# Altium schematic sheet LEDeep_project.SchDoc
size A3; SheetNumber: 1; SheetTotal: 7
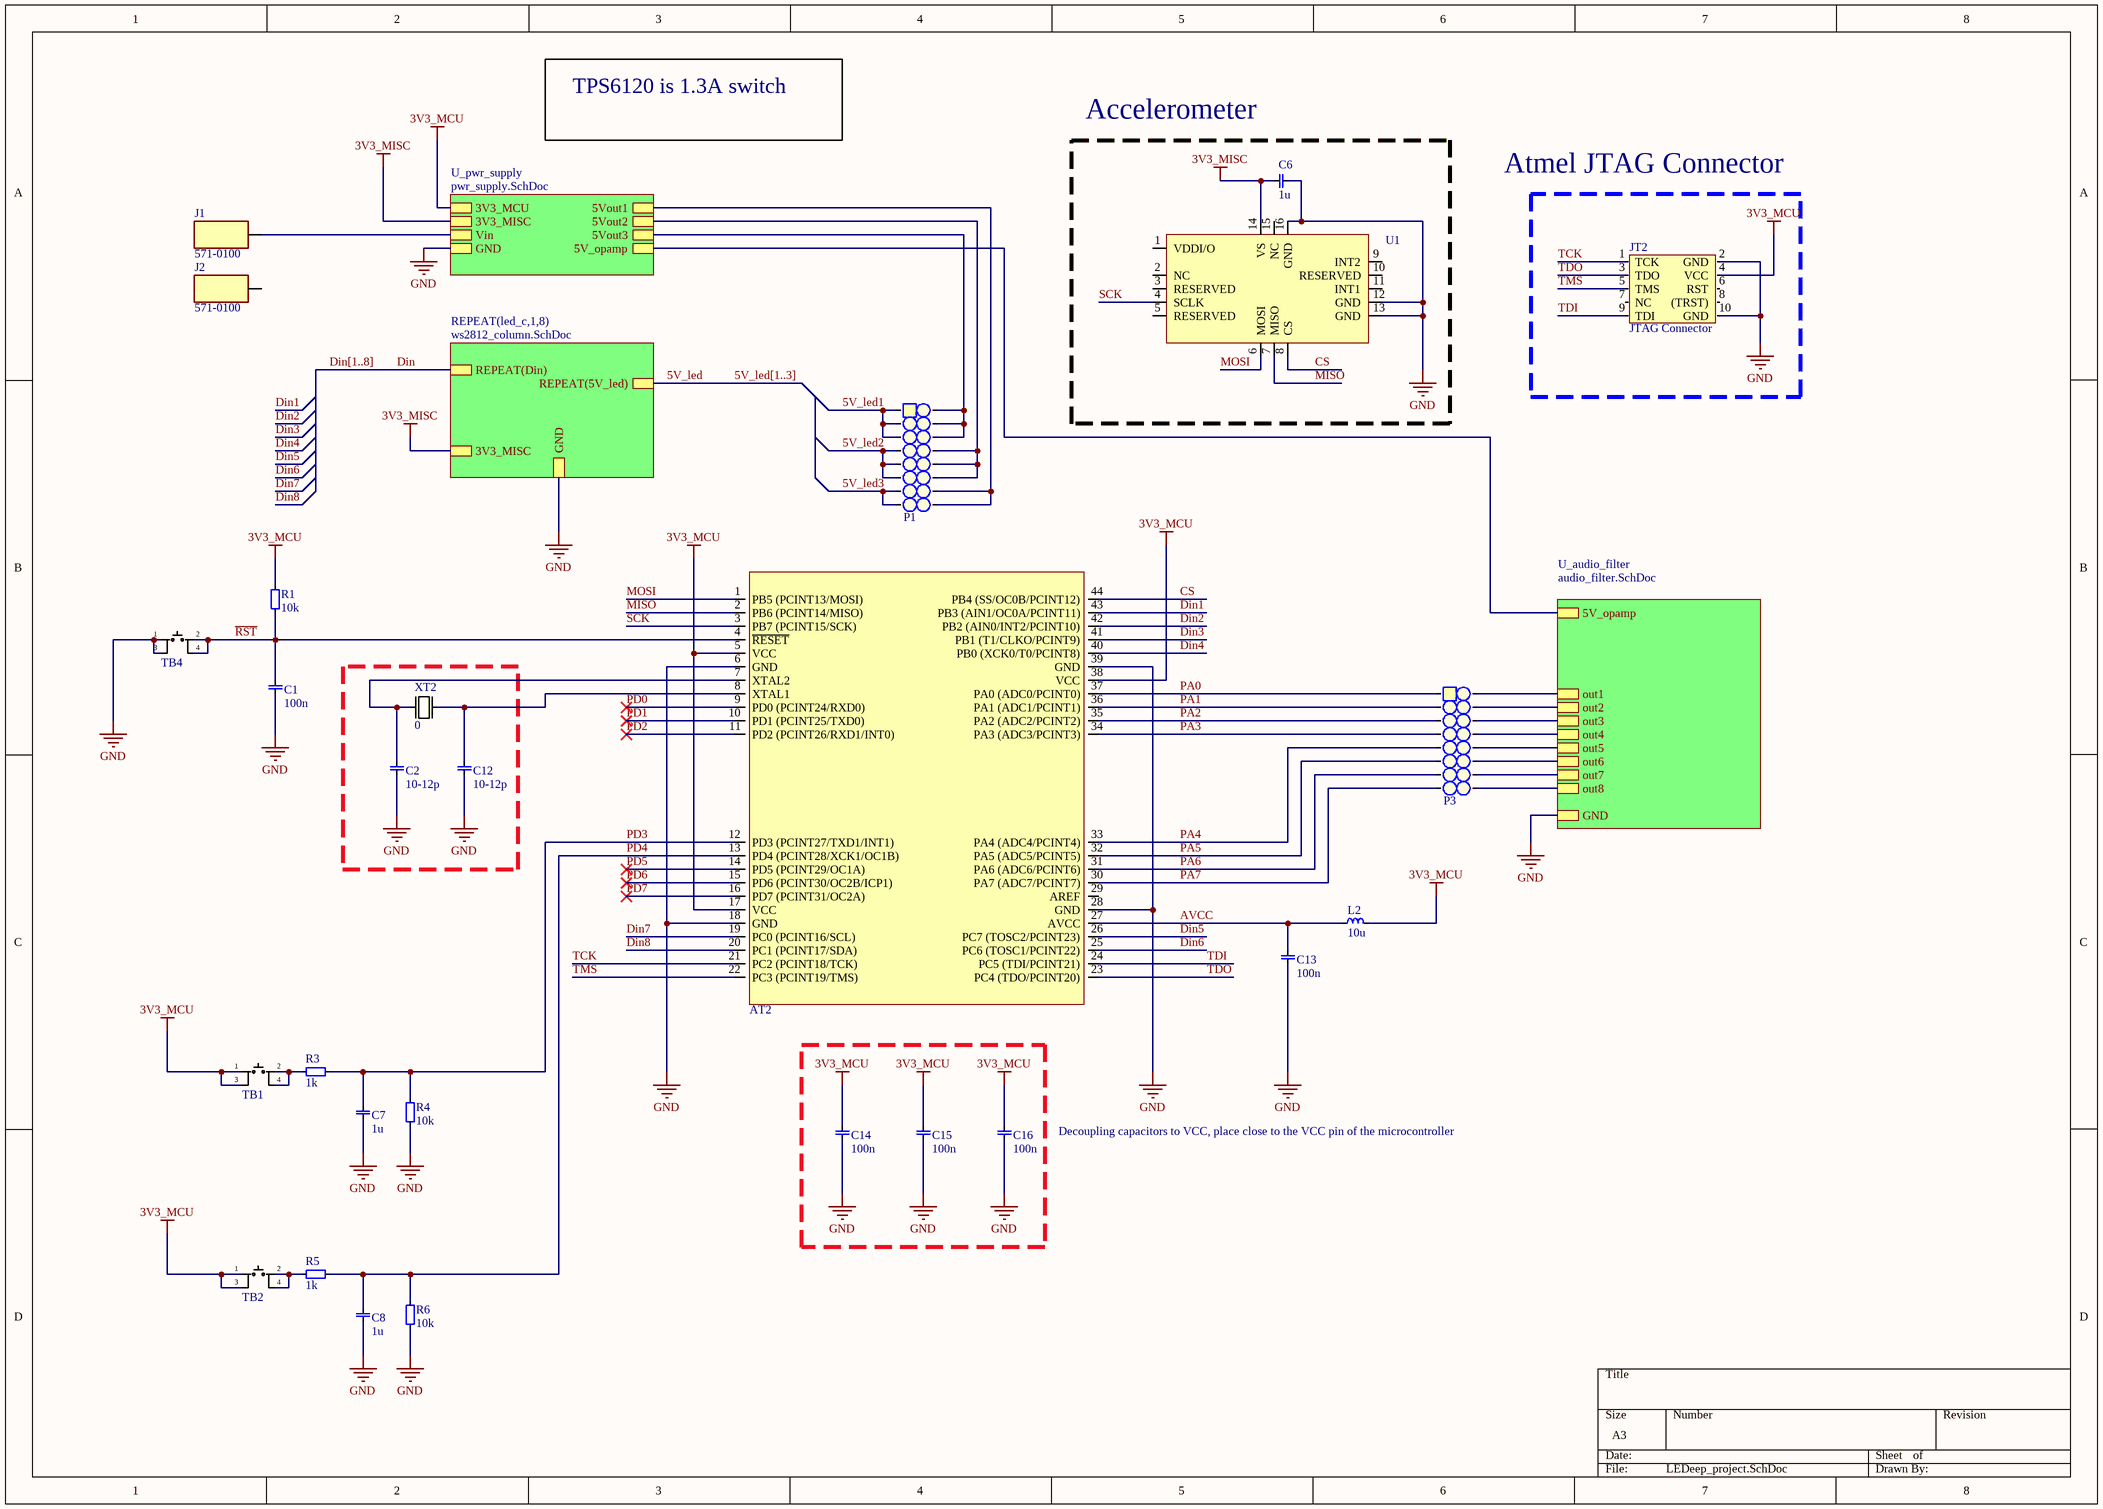
[diagram p0: LEDeep_project.SchDoc]

## Parts
AT2  ATmega644PA  [TQFP-44]  (value not drawn)
C1  value 100n  [1206, capasitor]  (hidden comment: 1206, capacitor)
C2  value 10-12p  [1206, capasitor]  (hidden comment: 1206, capacitor)
C6  value 1u  [1206, capasitor]  (hidden comment: 1206, capacitor)
C7  value 1u  [1206, capasitor]  (hidden comment: 1206, capacitor)
C8  value 1u  [1206, capasitor]  (hidden comment: 1206, capacitor)
C12  value 10-12p  [1206, capasitor]  (hidden comment: 1206, capacitor)
C13  value 100n  [1206, capasitor]  (hidden comment: 1206, capacitor)
C14  value 100n  [1206, capasitor]  (hidden comment: 1206, capacitor)
C15  value 100n  [1206, capasitor]  (hidden comment: 1206, capacitor)
C16  value 100n  [1206, capasitor]  (hidden comment: 1206, capacitor)
J1  571-0100  [Banana Conn VCC]
J2  571-0100  [Banana Conn VCC]
JT2  JTAG Connector  [Atmel_JTAG]
L2  value 10u  [1812, coil]  (hidden comment: Coil)
P1  2x8 Pin Header  [2x8 Pin Header]  (value not drawn)
P3  2x8 Pin Header  [2x8 Pin Header]  (value not drawn)
R1  value 10k  [1206]  (hidden comment: 1206, resistor)
R3  value 1k  [1206]  (hidden comment: 1206, resistor)
R4  value 10k  [1206]  (hidden comment: 1206, resistor)
R5  value 1k  [1206]  (hidden comment: 1206, resistor)
R6  value 10k  [1206]  (hidden comment: 1206, resistor)
TB1  Tactile Button  [Button smd]  (value not drawn)
TB2  Tactile Button  [Button smd]  (value not drawn)
TB4  Tactile Button  [Button smd]  (value not drawn)
U1  ADXL344  [lag_16_5by3_3x3mm]  (value not drawn)
XT2  value 0  [XTAL_SMD_LP]  (hidden comment: XTAL TXC 7A)

## Blocks framed on the sheet
Accelerometer: C6 U1

## Sub-sheets
REPEAT(led_c,1,8) = ws2812_column.SchDoc: GND, REPEAT(5V_led), REPEAT(Din), 3V3_MISC
U_audio_filter = audio_filter.SchDoc: 5V_opamp, GND, out6, out2, out3, out5, out1, out4, out7, out8
U_pwr_supply = pwr_supply.SchDoc: Vin, GND, 5Vout1, 5Vout2, 5Vout3, 3V3_MISC, 3V3_MCU, 5V_opamp

## Nets
3V3_MCU: AT2.5(VCC) AT2.17(VCC) AT2.38(VCC) C14.1 C15.1 C16.1 JT2.4(VCC) L2.1 R1.0 TB1.1 TB1.3 TB2.1 TB2.3 ; sheet U_pwr_supply/3V3_MCU
3V3_MISC: C6.0 U1.14(VS) ; sheet U_pwr_supply/3V3_MISC, sheet REPEAT(led_c,1,8)/3V3_MISC
GND: AT2.6(GND) AT2.18(GND) AT2.28(GND) AT2.39(GND) C1.0 C2.0 C6.1 C7.0 C8.0 C12.0 C13.0 C14.0 C15.0 C16.0 JT2.2(GND) JT2.10(GND) R4.1 R6.1 TB4.1 TB4.3 U1.12(GND) U1.13(GND) U1.16(GND) ; sheet U_pwr_supply/GND, sheet REPEAT(led_c,1,8)/GND, sheet U_audio_filter/GND
5V_led: sheet REPEAT(led_c,1,8)/REPEAT(5V_led)
5V_led1: P1.1 P1.2 P1.3
5V_led2: P1.4 P1.5 P1.6
5V_led3: P1.7 P1.8
AVCC: AT2.27(AVCC) C13.1 L2.2
CS: AT2.44(PB4_(SS/OC0B/PCINT12)) U1.8(CS)
Din: sheet REPEAT(led_c,1,8)/REPEAT(Din)
Din1: AT2.43(PB3_(AIN1/OC0A/PCINT11))
Din2: AT2.42(PB2_(AIN0/INT2/PCINT10))
Din3: AT2.41(PB1_(T1/CLKO/PCINT9))
Din4: AT2.40(PB0_(XCK0/T0/PCINT8))
Din5: AT2.26(PC7_(TOSC2/PCINT23))
Din6: AT2.25(PC6_(TOSC1/PCINT22))
Din7: AT2.19(PC0_(PCINT16/SCL))
Din8: AT2.20(PC1_(PCINT17/SDA))
MISO: AT2.2(PB6_(PCINT14/MISO)) U1.7(MISO)
MOSI: AT2.1(PB5_(PCINT13/MOSI)) U1.6(MOSI)
PA0: AT2.37(PA0_(ADC0/PCINT0)) P3.1
PA1: AT2.36(PA1_(ADC1/PCINT1)) P3.2
PA2: AT2.35(PA2_(ADC2/PCINT2)) P3.3
PA3: AT2.34(PA3_(ADC3/PCINT3)) P3.4
PA4: AT2.33(PA4_(ADC4/PCINT4)) P3.5
PA5: AT2.32(PA5_(ADC5/PCINT5)) P3.6
PA6: AT2.31(PA6_(ADC6/PCINT6)) P3.7
PA7: AT2.30(PA7_(ADC7/PCINT7)) P3.8
PD0: AT2.9(PD0_(PCINT24/RXD0))
PD1: AT2.10(PD1_(PCINT25/TXD0))
PD2: AT2.11(PD2_(PCINT26/RXD1/INT0))
PD3: AT2.12(PD3_(PCINT27/TXD1/INT1)) C7.1 R3.0 R4.0
PD4: AT2.13(PD4_(PCINT28/XCK1/OC1B)) C8.1 R5.0 R6.0
PD5: AT2.14(PD5_(PCINT29/OC1A))
PD6: AT2.15(PD6_(PCINT30/OC2B/ICP1))
PD7: AT2.16(PD7_(PCINT31/OC2A))
~{RST}: AT2.4(~{RESET}) C1.1 R1.1 TB4.2 TB4.4
SCK: AT2.3(PB7_(PCINT15/SCK)) U1.4(SCLK)
TCK: AT2.21(PC2_(PCINT18/TCK)) JT2.1(TCK)
TDI: AT2.24(PC5_(TDI/PCINT21)) JT2.9(TDI)
TDO: AT2.23(PC4_(TDO/PCINT20)) JT2.3(TDO)
TMS: AT2.22(PC3_(PCINT19/TMS)) JT2.5(TMS)
NetAT2_7: AT2.7(XTAL2) C2.1 XT2.1
NetAT2_8: AT2.8(XTAL1) C12.1 XT2.2
NetJ1_1: J1.1 ; sheet U_pwr_supply/Vin
NetP1_9: P1.9 P1.10 ; sheet U_pwr_supply/5Vout1
NetP1_11: P1.11 P1.12 P1.13 ; sheet U_pwr_supply/5Vout2
NetP1_14: P1.14 P1.15 P1.16 ; sheet U_pwr_supply/5Vout3
NetP3_9: P3.9 ; sheet U_audio_filter/out8
NetP3_10: P3.10 ; sheet U_audio_filter/out7
NetP3_11: P3.11 ; sheet U_audio_filter/out6
NetP3_12: P3.12 ; sheet U_audio_filter/out5
NetP3_13: P3.13 ; sheet U_audio_filter/out4
NetP3_14: P3.14 ; sheet U_audio_filter/out3
NetP3_15: P3.15 ; sheet U_audio_filter/out2
NetP3_16: P3.16 ; sheet U_audio_filter/out1
NetR3_1: R3.1 TB1.2 TB1.4
NetR5_1: R5.1 TB2.2 TB2.4
(unnamed): sheet U_pwr_supply/5V_opamp, sheet U_audio_filter/5V_opamp

Not connected (* = marked no-connect by the designer): AT2 29(AREF); J2 1; JT2 6(RST) 7(NC) 8((TRST)); U1 1(VDDI/O) 2(NC) 3(RESERVED) 5(RESERVED) 9(INT2) 10(RESERVED) 11(INT1) 15(NC)

## Buses and harness runs
bus 5V_led[1..3]
bus Din[1..8]

## Notes on the sheet
- TPS6120 is 1.3A switch
- Atmel JTAG Connector
- Decoupling capacitors to VCC, place close to the VCC pin of the microcontroller

## Library data of the parts
AT2 = ATmega644PA: ATmega644PA - Small but big and PicoPower; Farnell: 2484915; Value: ATmega644PA
J1 J2 = Banana conn: Banana Connector 571-0100; Manufacturer_Name: Deltron; Datasheet Link: https://www.dem-uk.com/deltron-components/Data/Product_Downloads/deltron-571-0100-4mm-90deg-single-socket-data.pdf; Height: 12.4mm; Manufacturer_Part_Number: 571-0100; Mouser Part Number: 164-6218; Mouser Price/Stock: https://www.mouser.com/Search/Refine.aspx?Keyword=164-6218
JT2 = Atmel JTAG: Atmel JTAG Connector
P1 P3 = 2x8 Pin Header: 2.54 mm; Value: 1x8 Pin Header
R1 R3-R6 = 1206, resistor: Resistor
  R1 R4 R6: DigiKey: RMCF1206JT10K0CT-ND
  R3 R5: DigiKey: RPC1206JT1K00CT-ND
TB1 TB2 TB4 = Button SMD: Tactile Switch Small Low; ELFA: 110-87-406; Value: Button SMD
U1 = ADXL344: 3-Axis, ±2 g/±4 g/±8 g/±16 g Ultralow / Power Digital MEMS Accelerometer; DigiKey: ADXL344ACCZ-RL7
XT2 = XTAL TXC 7A: 16 MHz, SMD, 5mm x 3,2mm, 30 ppm; Farnell: 1841946
C1 C2 C6-C8 C12-C16 = 1206, capacitor
  C1 C13-C16: DigiKey: 399-C1206C104M5RACAUTOCT-ND
  C2 C12: DigiKey: 399-C1206C100J5GAC7800CT-ND
  C6-C8: DigiKey: 1276-3298-1-ND